# Altium schematic sheet CHRG 1xCell MCP73831.SchDoc
size 185 x 74 mm
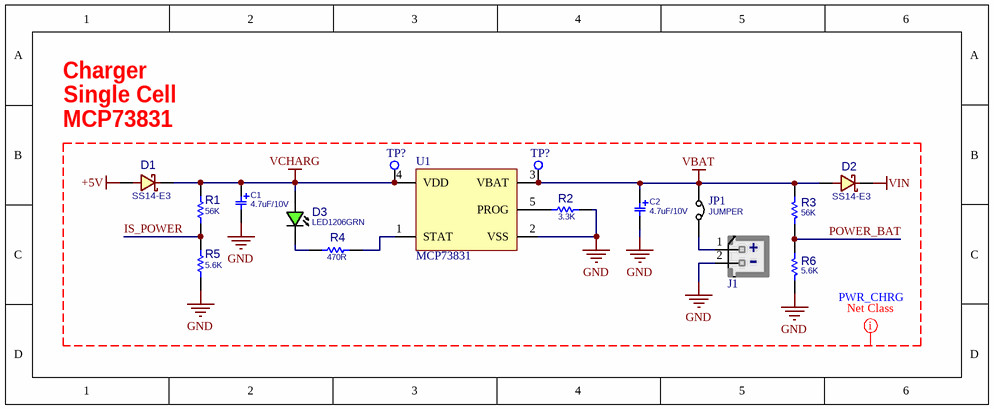
[diagram p0: CHRG 1xCell MCP73831.SchDoc]

## Parts
(Parts that share a designator on the sheet are numbered #1, #2 ... from top to bottom, then left to right.)
C1  4.7uF/10V  [C_TN_A]
C2  4.7uF/10V  [C_TN_A]
D1  SS14-E3  [D_SMA]
D2  SS14-E3  [D_SMA]
D3  LED1206GRN  [LED1206GRN]
J1  HHDR_2  [XH_2]  (value not drawn)
JP1  JUMPER  [JP_2_BLK]
R1  56K  [R0603S]
R2  3.3K  [R0603S]
R3  56K  [R0603S]
R4  470R  [R0603S]
R5  5.6K  [R0603S]
R6  5.6K  [R0603S]
TP?#1  Test Point  [TPSMD_C1]  (value not drawn)
TP?#2  Test Point  [TPSMD_C1]  (value not drawn)
U1  MCP73831  [SOT23_5]

## Nets
+5V: D1.1
GND: C1.2 C2.2 J1.2 R2.1 R5.1 R6.1 U1.2(VSS)
VBAT: C2.1 D2.1 JP1.1 R3.2 TP?#2.1(TP) U1.3(VBAT)
VCHARG: C1.1 D1.2 D3.1(ANODE) R1.2 TP?#1.1(TP) U1.4(VDD)
VIN: D2.2
IS_POWER: R1.1 R5.2
POWER_BAT: R3.1 R6.2
NetD3_2: D3.2(CATHODE) R4.2
NetJ1_1: J1.1 JP1.2
NetR2_2: R2.2 U1.5(PROG)
NetR4_1: R4.1 U1.1(STAT)

## Layout directives
net class PWR_CHRG: +5V, GND, IS_POWER, POWER_BAT, VBAT, VCHARG, VIN

## Notes on the sheet
- Charger
- MCP73831
- Single Cell
- (near R6) PWR_CHRG
- (in symbol CONN_PW_POWER_CNT_254_1X2) +; -

## Library data of the parts
C1 C2 = CAP_SMD_TAN: CAP, SMD, TAN; PARAM: 10V; VALUE: 4.7uF/10V
D1 D2 = DIODE_SMD_SCHOTTKY_SS14-E3: DIODE, SCHOTTKY, 40V, 1A; MANF: Vishay; DESC: DESCRIPTION; ASSEMBLY: ASSEMBLY; PRICE: PRICE; PARAM2: 1A; PARAM: 40V; MANF_P#: SS14-E3; VALUE: SS14-E3
D3 = LED_SMD_1206_GRN: LED, SMD, 1206, GREEN; PARAM: 20mA; DESC: DESCRIPTION; PARAM2: 2.2V; MANF: -; ASSEMBLY: ASSEMBLY; PRICE: 36t@Javan; MANF_P#: -; VALUE: LED1206GRN
J1 = CONN_PW_POWER_CNT_254_1X2: CONN, CNT, pitch: 2.54mm, 2POS; VALUE: HHDR_2
JP1 = JUMPER_HDR_2P: JUMPER, HEADER 2PIN; MANF: MANF; MANF_P#: MANF_P#; VALUE: JUMPER
R1-R6 = RES_SMD: RES, SMD; MANF_P#: RK73H1ETTP4701F; MANF: KOA SPEER; PARAM: 0.063W; DESC: DESCRIPTION; DIST#: MOUSER; PARAM2: 1%; ASSEMBLY: ASSEMBLY; PRICE: 100= 0.5$
  R1 R3: VALUE: 56K
  R2: VALUE: 3.3K
  R4: VALUE: 470R
  R5 R6: VALUE: 5.6K
U1 = MCP73831: Charger IC